# Altium schematic sheet V_3.SchDoc
size A4
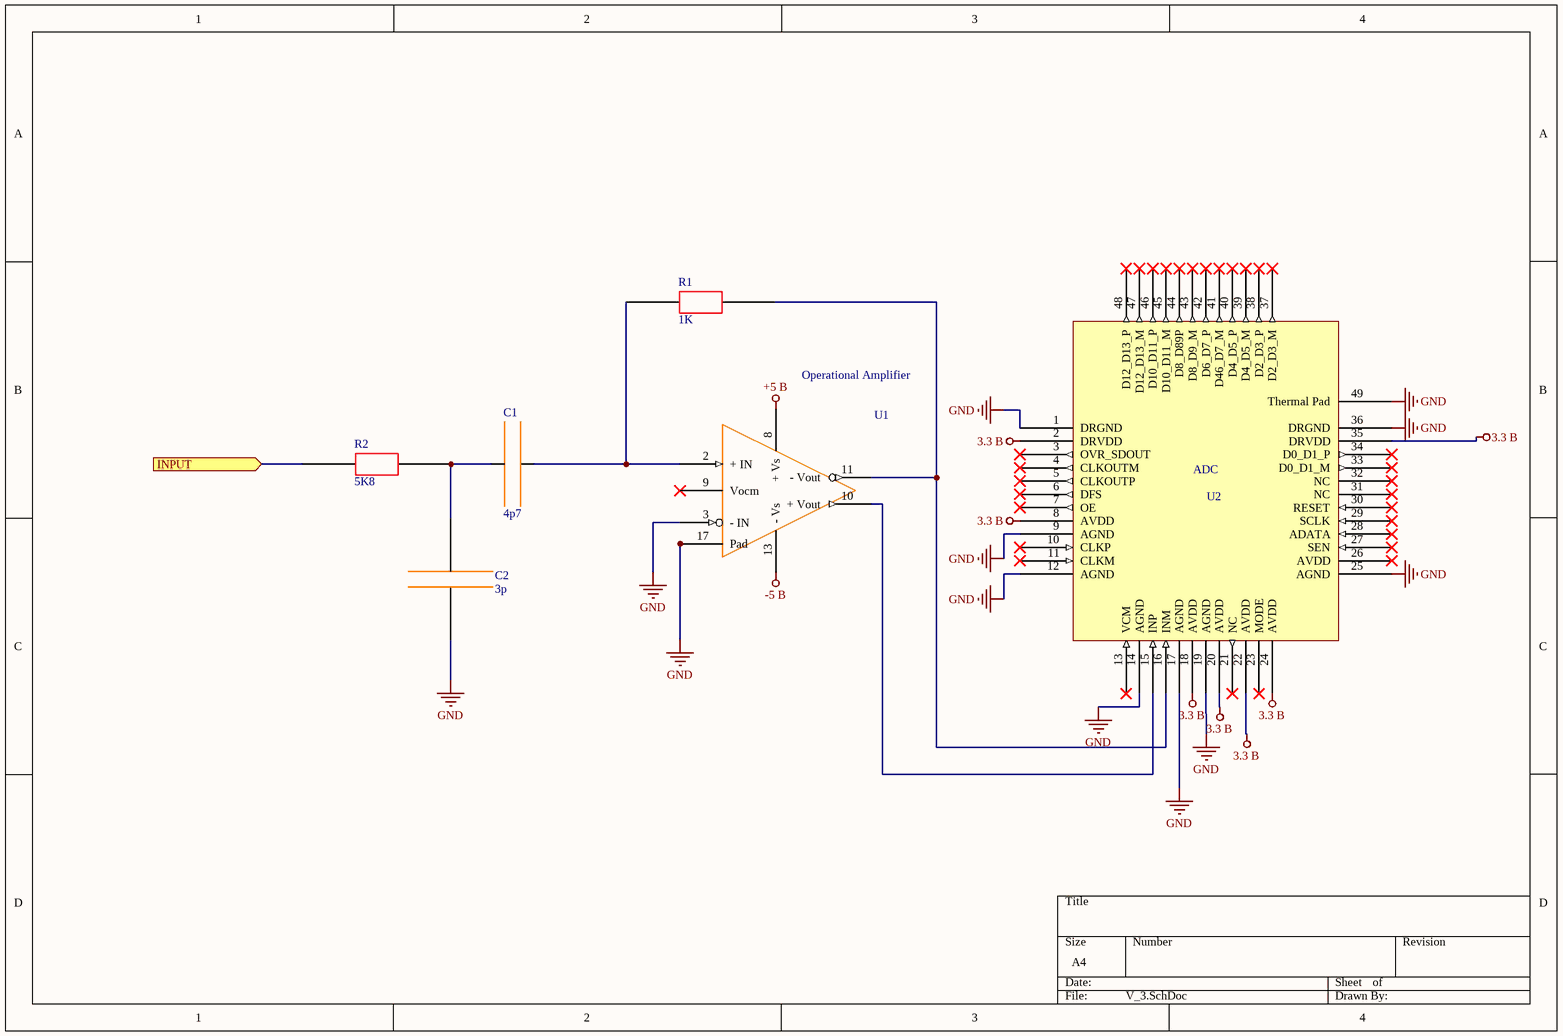
[diagram p0: V_3.SchDoc]

## Parts
C1  4p7  [C_0805]
C2  3p  [C_0805]
R1  1K  [R_0805]
R2  5K8  [R_0805]
U1  Operational Amplifier  [ADA4932-1]
U2  ADC  [ADS61B49]

## Ports
INPUT (in)

## Nets
3.3 B: U2.2(DRVDD) U2.8(AVDD) U2.18(AVDD) U2.20(AVDD) U2.22(AVDD) U2.24(AVDD) U2.35(DRVDD)
+5 B: U1.8(+_Vs)
-5 B: U1.13(-_Vs)
GND: C2.3 U1.3(-_IN) U1.17(Pad) U2.1(DRGND) U2.9(AGND) U2.12(AGND) U2.14(AGND) U2.17(AGND) U2.19(AGND) U2.25(AGND) U2.36(DRGND) U2.49(Thermal_Pad)
INPUT: R2.1 ; port INPUT
NetC1_3: C1.3 R1.1 U1.2(+_IN)
NetC1_4: C1.4 C2.4 R2.2
NetR1_2: R1.2 U1.11(-_Vout) U2.16(INM)
NetU1_10: U1.10(+_Vout) U2.15(INP)

Not connected (* = marked no-connect by the designer): U1 9(Vocm)*; U2 3(OVR_SDOUT)* 4(CLKOUTM)* 5(CLKOUTP)* 6(DFS)* 7(OE)* 10(CLKP)* 11(CLKM)* 13(VCM)* 21(NC)* 23(MODE)* 26(AVDD)* 27(SEN)* 28(ADATA)* 29(SCLK)* 30(RESET)* 31(NC)* 32(NC)* 33(D0_D1_M)* 34(D0_D1_P)* 37(D2_D3_M)* 38(D2_D3_P)* 39(D4_D5_M)* 40(D4_D5_P)* 41(D46_D7_M)* 42(D6_D7_P)* 43(D8_D9_M)* 44(D8_D89P)* 45(D10_D11_M)* 46(D10_D11_P)* 47(D12_D13_M)* 48(D12_D13_P)*

## Library data of the parts
C1 C2 = Condenser
R1 R2 = Resistor